# Altium schematic sheet RE.-SYS-final.SchDoc
size A3
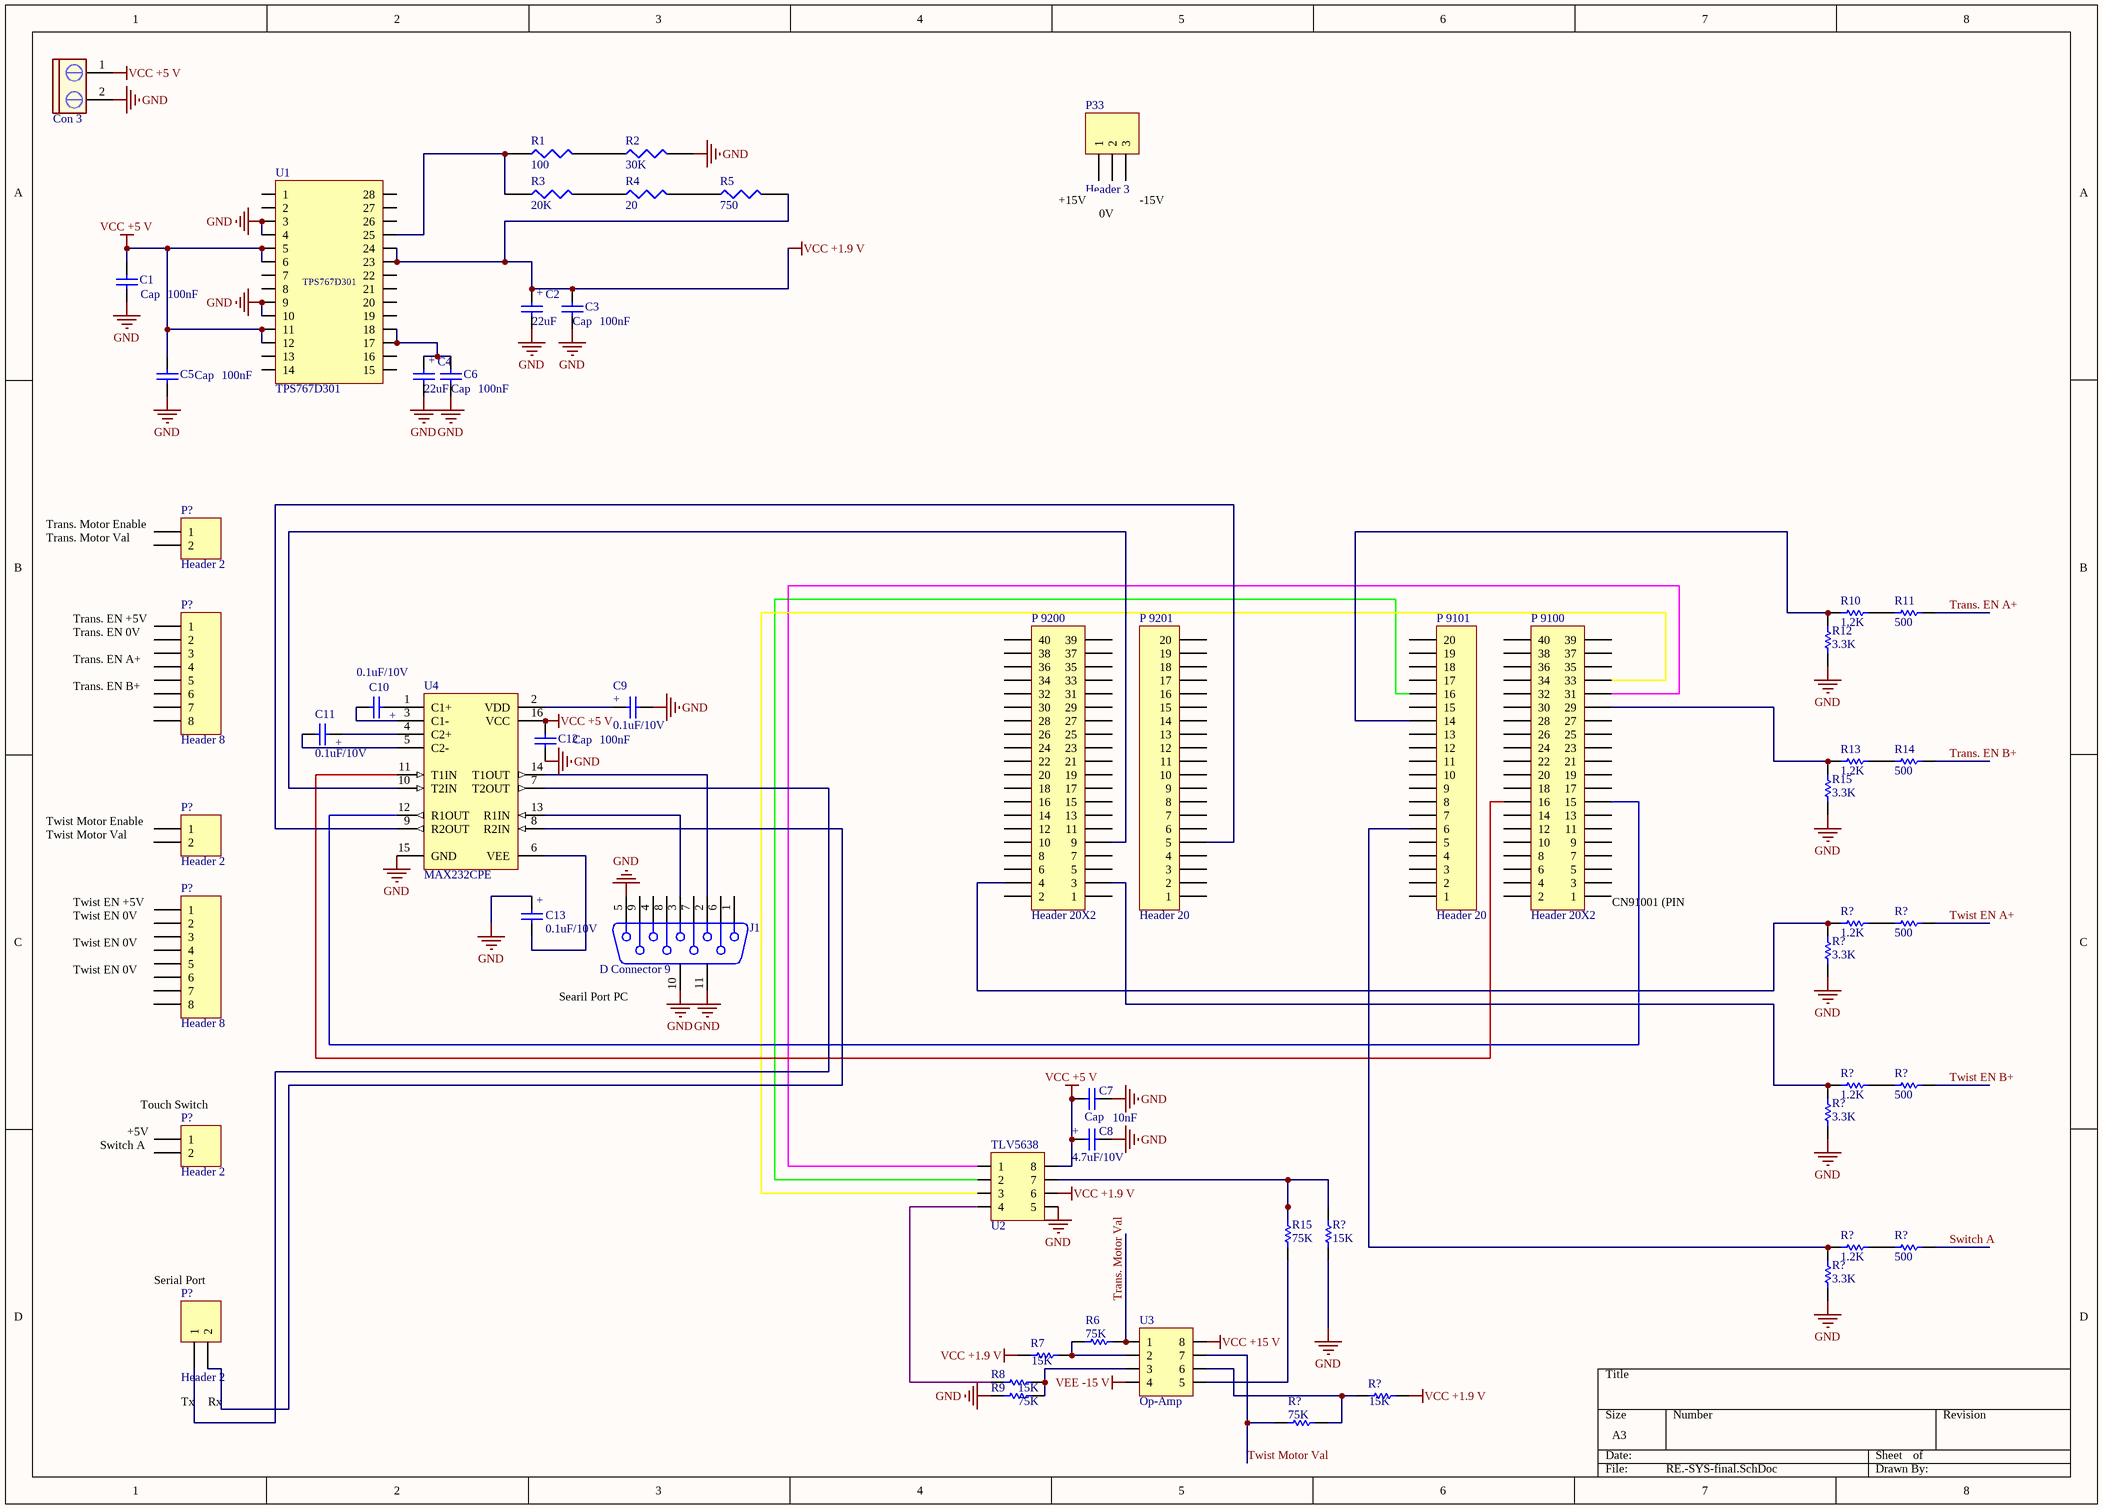
[diagram p0: RE.-SYS-final.SchDoc]

## Parts
(Parts that share a designator on the sheet are numbered #1, #2 ... from top to bottom, then left to right.)
C1  Cap  value 100nF  [RAD-0.3]
C2  value 22uF  [My_cap3300u]  (hidden comment: Cap)
C3  Cap  value 100nF  [RAD-0.3]
C4  value 22uF  [My_cap3300u]  (hidden comment: Cap)
C5  Cap  value 100nF  [RAD-0.3]
C6  Cap  value 100nF  [RAD-0.3]
C7  Cap  value 10nF  [RAD-0.3]
C8  value 4.7uF/10V  [My_cap3300u]  (hidden comment: Cap)
C9  value 0.1uF/10V  [My_cap3300u]  (hidden comment: Cap)
C10  value 0.1uF/10V  [My_cap3300u]  (hidden comment: Cap)
C11  value 0.1uF/10V  [My_cap3300u]  (hidden comment: Cap)
C12  Cap  value 100nF  [RAD-0.3]
C13  value 0.1uF/10V  [My_cap3300u]  (hidden comment: Cap)
Con_3  CON2 pin blue  [My_CN2]  (value not drawn)
J1  D Connector 9  [DSUB1.385-2H9]
P33  Header 3  [HDR1X3]
P?#1  Header 2  [HDR1X2]
P?#2  Header 8  [HDR1X8]
P?#3  Header 2  [HDR1X2]
P?#4  Header 8  [HDR1X8]
P?#5  Header 2  [HDR1X2]
P?#6  Header 2  [HDR1X2]
P_9100  Header 20X2  [HDR2X20]
P_9101  Header 20  [HDR1X20]
P_9200  Header 20X2  [HDR2X20]
P_9201  Header 20  [HDR1X20]
R1  value 100  [My_axial-0.4]  (hidden comment: 1k)
R2  value 30K  [My_axial-0.4]  (hidden comment: 1k)
R3  value 20K  [My_axial-0.4]  (hidden comment: 1k)
R4  value 20  [My_axial-0.4]  (hidden comment: 1k)
R5  value 750  [My_axial-0.4]  (hidden comment: 1k)
R6  value 75K  [AXIAL-0.3]  (hidden comment: Res1)
R7  value 15K  [AXIAL-0.3]  (hidden comment: Res1)
R8  value 15K  [AXIAL-0.3]  (hidden comment: Res1)
R9  value 75K  [AXIAL-0.3]  (hidden comment: Res1)
R10  value 1.2K  [AXIAL-0.3]  (hidden comment: Res1)
R11  value 500  [AXIAL-0.3]  (hidden comment: Res1)
R12  value 3.3K  [AXIAL-0.3]  (hidden comment: Res1)
R13  value 1.2K  [AXIAL-0.3]  (hidden comment: Res1)
R14  value 500  [AXIAL-0.3]  (hidden comment: Res1)
R15#1  value 3.3K  [AXIAL-0.3]  (hidden comment: Res1)
R15#2  value 75K  [AXIAL-0.3]  (hidden comment: Res1)
R?#1  value 1.2K  [AXIAL-0.3]  (hidden comment: Res1)
R?#2  value 500  [AXIAL-0.3]  (hidden comment: Res1)
R?#3  value 3.3K  [AXIAL-0.3]  (hidden comment: Res1)
R?#4  value 1.2K  [AXIAL-0.3]  (hidden comment: Res1)
R?#5  value 500  [AXIAL-0.3]  (hidden comment: Res1)
R?#6  value 3.3K  [AXIAL-0.3]  (hidden comment: Res1)
R?#7  value 15K  [AXIAL-0.3]  (hidden comment: Res1)
R?#8  value 1.2K  [AXIAL-0.3]  (hidden comment: Res1)
R?#9  value 500  [AXIAL-0.3]  (hidden comment: Res1)
R?#10  value 3.3K  [AXIAL-0.3]  (hidden comment: Res1)
R?#11  value 75K  [AXIAL-0.3]  (hidden comment: Res1)
R?#12  value 15K  [AXIAL-0.3]  (hidden comment: Res1)
U1  TPS767D301  [SMD Reg.]
U2  TLV5638  [SMD IC FP]
U3  Op-Amp  [PCBComponent_1]
U4  MAX232CPE  [PE16A]

## Nets
GND: C1.1 C2.- C3.1 C4.- C5.1 C6.1 C7.1 C8.- C9.- C12.1 C13.+ Con_3.2 J1.5 J1.10(MH1) J1.11(MH2) R2.2 R9.1 R12.1 R15#1.1 R?#3.1 R?#6.1 R?#7.2 R?#10.1 U1.3 U1.4 U1.9 U1.10 U2.5 U4.15(GND)
VCC +1.9 V: C2.+ C3.2 R5.2 R7.2 R?#12.1 U1.23 U1.24 U2.6
VCC +5 V: C1.2 C5.2 C7.2 C8.+ C12.2 Con_3.1 U1.5 U1.6 U1.11 U1.12 U2.8 U4.16(VCC)
VCC +15 V: U3.8
VEE -15 V: U3.4
Switch A: R?#9.1
Trans. EN A+: R11.1
Trans. EN B+: R14.1
Trans. Motor Val: R6.2 U3.1
Twist EN A+: R?#2.1
Twist EN B+: R?#5.1
Twist Motor Val: R?#11.1 U3.7
NetC4_+: C4.+ C6.2 U1.17 U1.18
NetC9_+: C9.+ U4.2(VDD)
NetC10_+: C10.+ U4.1(C1+)
NetC10_-: C10.- U4.3(C1-)
NetC11_+: C11.+ U4.4(C2+)
NetC11_-: C11.- U4.5(C2-)
NetC13_-: C13.- U4.6(VEE)
NetJ1_2: J1.2 U4.14(T1OUT)
NetJ1_3: J1.3 U4.13(R1IN)
NetP?#6_1: P?#6.1 U4.7(T2OUT)
NetP?#6_2: P?#6.2 U4.8(R2IN)
NetP_9100_15: P_9100.15 U4.12(R1OUT)
NetP_9100_16: P_9100.16 U4.11(T1IN)
NetP_9100_29: P_9100.29 R13.2 R15#1.2
NetP_9100_31: P_9100.31 U2.1
NetP_9100_33: P_9100.33 U2.3
NetP_9101_6: P_9101.6 R?#8.2 R?#10.2
NetP_9101_14: P_9101.14 R10.2 R12.2
NetP_9101_16: P_9101.16 U2.2
NetP_9200_3: P_9200.3 R?#4.2 R?#6.2
NetP_9200_4: P_9200.4 R?#1.2 R?#3.2
NetP_9200_9: P_9200.9 U4.10(T2IN)
NetP_9201_5: P_9201.5 U4.9(R2OUT)
NetR1_1: R1.1 R3.1 U1.25
NetR1_2: R1.2 R2.1
NetR3_2: R3.2 R4.1
NetR4_2: R4.2 R5.1
NetR6_1: R6.1 R7.1 U3.2
NetR8_1: R8.1 R9.2 U3.3
NetR8_2: R8.2 U2.4
NetR10_1: R10.1 R11.2
NetR13_1: R13.1 R14.2
NetR15#2_1: R15#2.1 U3.5
NetR15#2_2: R15#2.2 R?#7.1 U2.7
NetR?#1_1: R?#1.1 R?#2.2
NetR?#4_1: R?#4.1 R?#5.2
NetR?#8_1: R?#8.1 R?#9.2
NetR?#11_2: R?#11.2 R?#12.2 U3.6

Not connected (* = marked no-connect by the designer): J1 1 4 6 7 8 9; P33 1 2 3; P?#1 1 2; P?#2 1 2 3 4 5 6 7 8; P?#3 1 2; P?#4 1 2 3 4 5 6 7 8; P?#5 1 2; P_9100 1 2 3 4 5 6 7 8 9 10 11 12 13 14 17 18 19 20 21 22 23 24 25 26 27 28 30 32 34 35 36 37 38 39 40; P_9101 1 2 3 4 5 7 8 9 10 11 12 13 15 17 18 19 20; P_9200 1 2 5 6 7 8 10 11 12 13 14 15 16 17 18 19 20 21 22 23 24 25 26 27 28 29 30 31 32 33 34 35 36 37 38 39 40; P_9201 1 2 3 4 6 7 8 9 10 11 12 13 14 15 16 17 18 19 20; U1 1 2 7 8 13 14 15 16 19 20 21 22 26 27 28

## Notes on the sheet
- (near P33) +15V
- (near P33) 0V
- (near P33) -15V
- (near P?#1) Trans. Motor Enable
- (near P?#1) Trans. Motor Val
- (near P?#2) Trans. EN +5V
- (near P?#2) Trans. EN 0V
- (near P?#2) Trans. EN A+
- (near P?#2) Trans. EN B+
- (near P?#3) Twist Motor Enable
- (near P?#3) Twist Motor Val
- (near P?#4) Twist EN +5V
- (near P?#4) Twist EN 0V
- (near P_9100) CN91001 (PIN 1)
- (near J1) Searil Port PC
- (near P?#5) Touch Switch
- (near P?#5) Switch A
- (near P?#5) +5V
- Serial Port (Slave DSP)
- (near P?#6) Tx
- (near P?#6) Rx

## Library data of the parts
C1 C3 C5-C7 C12 = Cap: Capacitor; Published: 8-Jun-2000; LatestRevisionDate: 17-Jul-2002; LatestRevisionNote: Re-released for DXP Platform.; PackageReference: RAD-0.3; Publisher: Altium Limited; PackageDescription: Radial Cap, Thru-Hole; 2 Leads; 0.3 in Pin Spacing
C2 C4 C8-C11 C13 = Cap Pol: CAP-3300Uf
Con_3 = CON2 pin blue: Connector blue screw
J1 = D Connector 9: Receptacle Assembly, 9 Position, Right Angle; PackageDocument: O; Positions: 9; Published: 15-Jun-2001; LatestRevisionDate: 17-Jul-2002; LatestRevisionNote: Re-released for DXP Platform.; DatasheetDocument: 1-Sep-1999; PackageReference: 788750; Publisher: Altium Limited; Orientation: Right Angle; Gender: Receptacle
P33 = Header 3: Header, 3-Pin; LatestRevisionDate: 17-Jul-2002; LatestRevisionNote: Re-released for DXP Platform.; Publisher: Altium Limited
P?#1 P?#3 P?#5 P?#6 = Header 2: Header, 2-Pin; LatestRevisionDate: 17-Jul-2002; LatestRevisionNote: Re-released for DXP Platform.; Publisher: Altium Limited
P?#2 P?#4 = Header 8: Header, 8-Pin; LatestRevisionDate: 17-Jul-2002; LatestRevisionNote: Re-released for DXP Platform.; Publisher: Altium Limited
P_9100 P_9200 = Header 20X2: Header, 20-Pin, Dual row; LatestRevisionDate: 17-Jul-2002; LatestRevisionNote: Re-released for DXP Platform.; Publisher: Altium Limited
P_9101 P_9201 = Header 20: Header, 20-Pin; LatestRevisionDate: 17-Jul-2002; LatestRevisionNote: Re-released for DXP Platform.; Publisher: Altium Limited
R1-R5 = Res: resistor 1/4 wat
R6-R14 R15#1 R15#2 R?#1-R?#12 = Res1: Resistor; Published: 8-Jun-2000; LatestRevisionDate: 17-Jul-2002; LatestRevisionNote: Re-released for DXP Platform.; PackageReference: AXIAL-0.3; Publisher: Altium Limited
U1 = SMD Reg.: Power Reg SMD IC
U2 = SMD IC: DAC
U3 = SMD_Comp.
U4 = MAX232CPE: +5V Powered RS-232 Driver/Receiver; Published: 16-Jan-2001; LatestRevisionDate: 29-May-2009; LatestRevisionNote: Component Body Added.; DatasheetVersion: Apr-1992; PackageVersion: 1997; PackageReference: PE16A; Publisher: Altium Limited; PackageDescription: DIP, 16-Pin, Row Spacing 7.62 mm, Pitch 2.54 mm; Code_JEDEC: MS-001-BB; ComponentLink1Description: Manufacturer Link; ComponentLink1URL: http://www.maxim-ic.com/; ComponentLink2Description: Datasheet; ComponentLink2URL: http://pdfserv.maxim-ic.com/en/ds/MAX220-MAX249.pdf